# Altium project Quadcopter.prjpcb
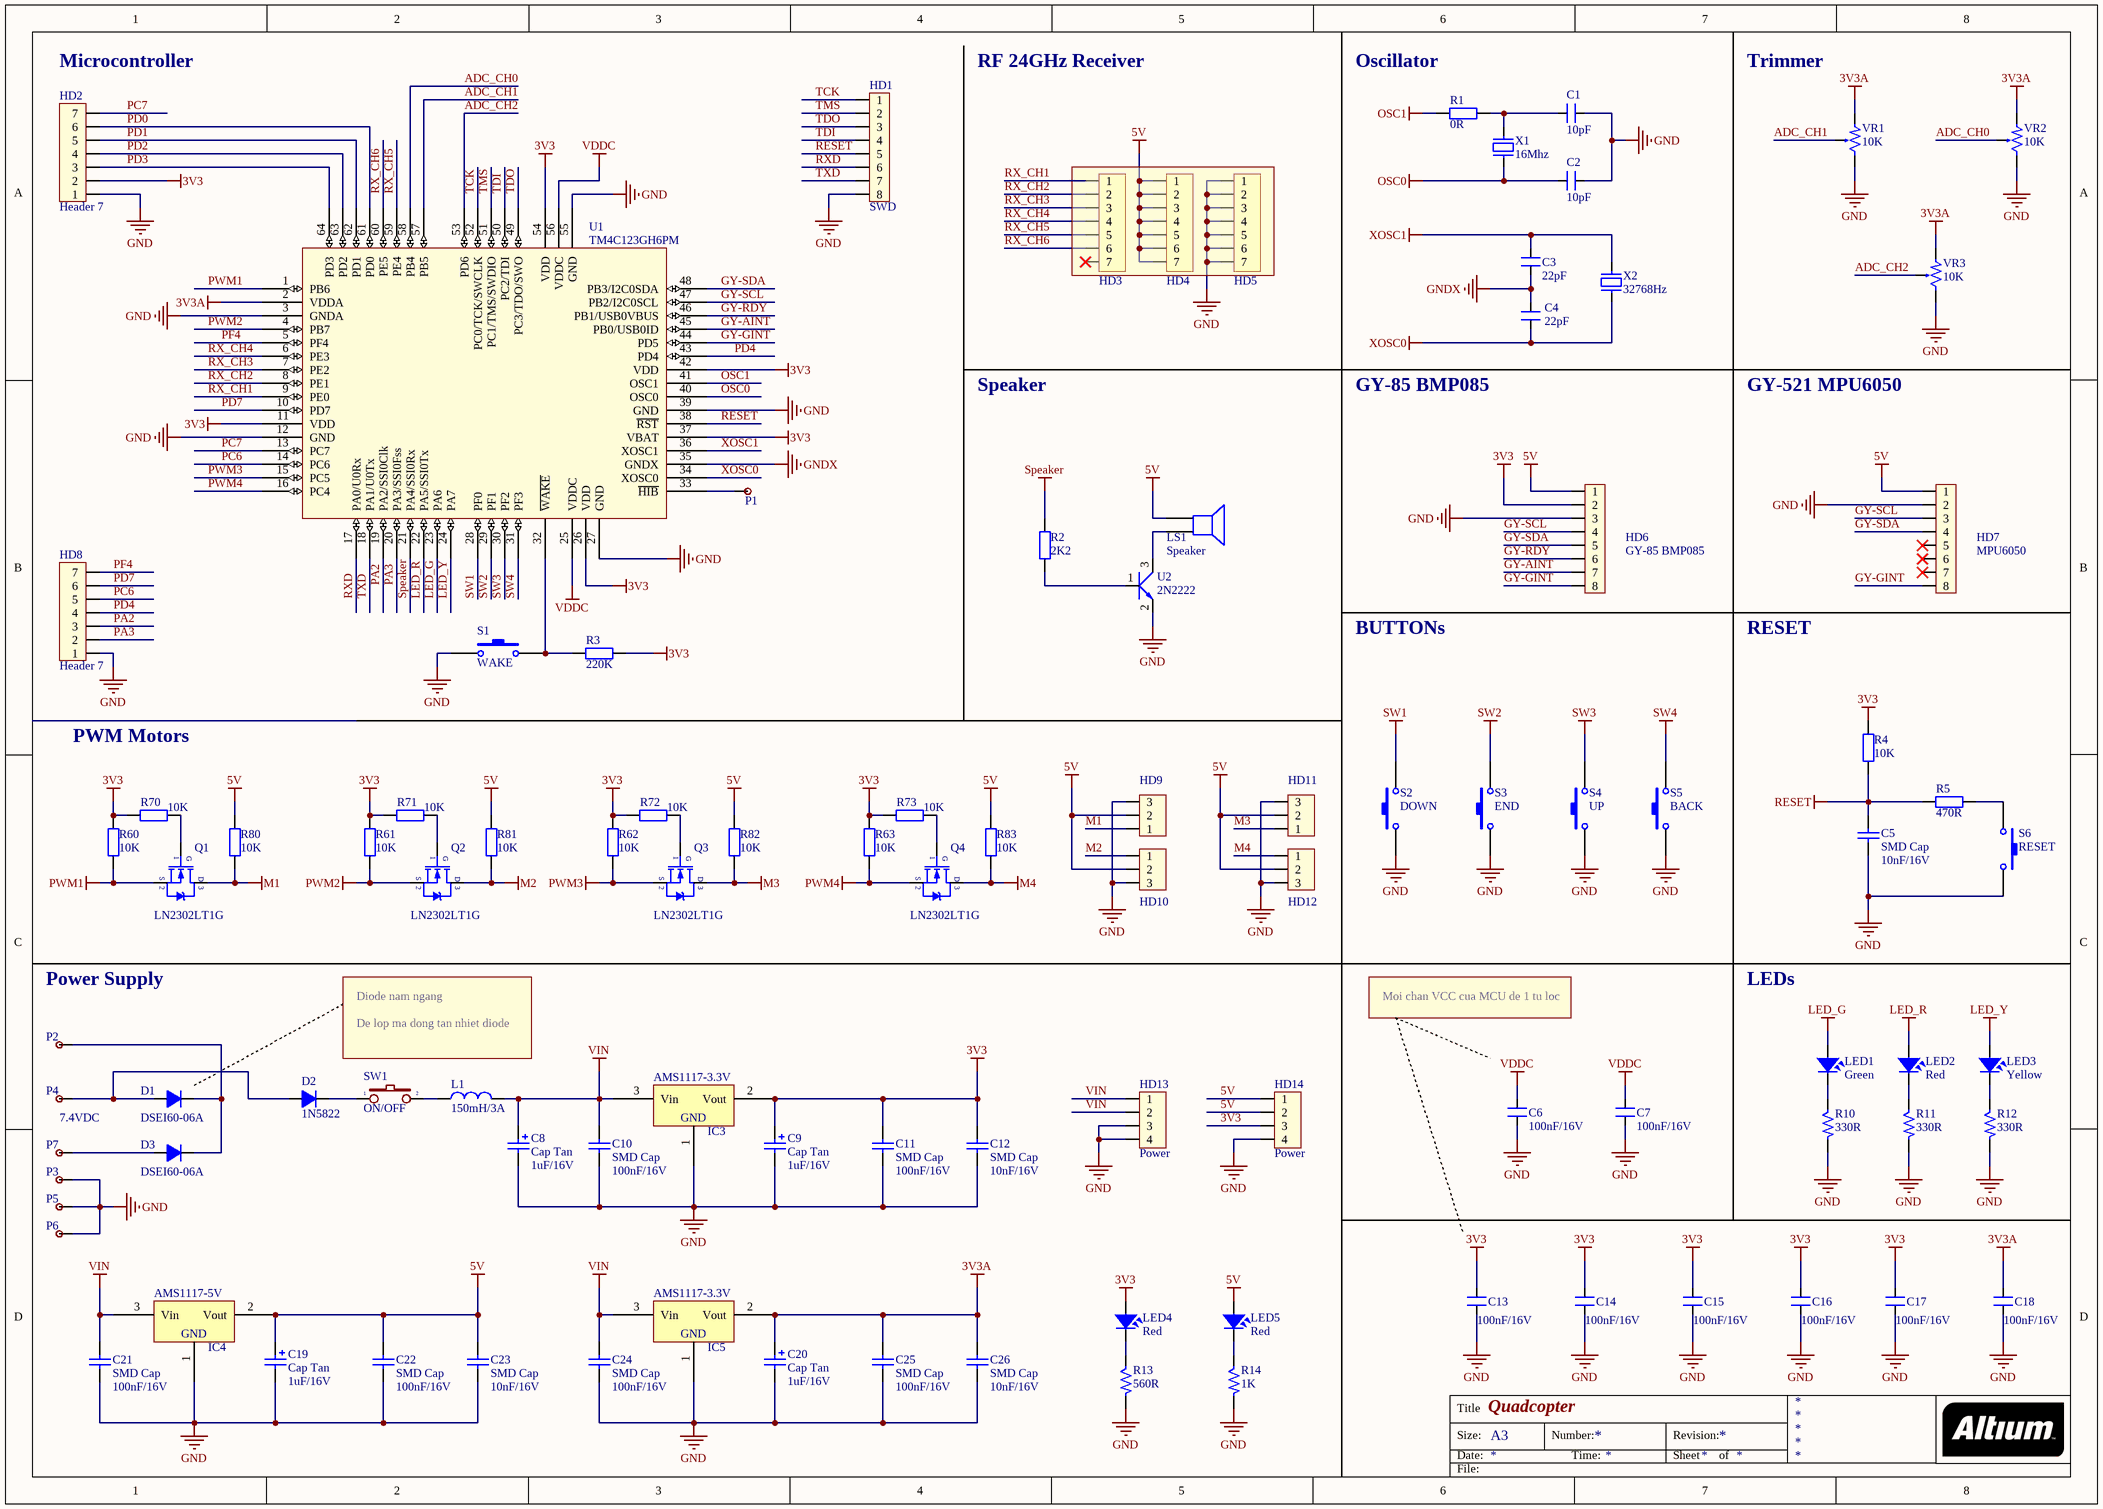
[diagram p0: Quadcopter.schdoc]
1 sheet, 100 parts. Net scope: global (net labels, ports and power ports of the same name join across sheets).
Board file: Quadcopter_final.PcbDoc

## Sheet Quadcopter.schdoc: Quadcopter
size A3

### Parts
C1  10pF  [C0603]
C2  10pF  [C0603]
C3  22pF  [C0603]
C4  22pF  [C0603]
C5  SMD Cap  value 10nF/16V  [C0603]
C6  value 100nF/16V  [C0603]  (hidden comment: SMD Cap)
C7  value 100nF/16V  [C0603]  (hidden comment: SMD Cap)
C8  Cap Tan  value 1uF/16V  [CAP_TANTA_1uF_16V]
C9  Cap Tan  value 1uF/16V  [CAP_TANTA_1uF_16V]
C10  SMD Cap  value 100nF/16V  [C0603]
C11  SMD Cap  value 100nF/16V  [C0603]
C12  SMD Cap  value 10nF/16V  [C0603]
C13  value 100nF/16V  [C0603]  (hidden comment: SMD Cap)
C14  value 100nF/16V  [C0603]  (hidden comment: SMD Cap)
C15  value 100nF/16V  [C0603]  (hidden comment: SMD Cap)
C16  value 100nF/16V  [C0603]  (hidden comment: SMD Cap)
C17  value 100nF/16V  [C0603]  (hidden comment: SMD Cap)
C18  value 100nF/16V  [C0603]  (hidden comment: SMD Cap)
C19  Cap Tan  value 1uF/16V  [CAP_TANTA_1uF_16V]
C20  Cap Tan  value 1uF/16V  [CAP_TANTA_1uF_16V]
C21  SMD Cap  value 100nF/16V  [C0603]
C22  SMD Cap  value 100nF/16V  [C0603]
C23  SMD Cap  value 10nF/16V  [C0603]
C24  SMD Cap  value 100nF/16V  [C0603]
C25  SMD Cap  value 100nF/16V  [C0603]
C26  SMD Cap  value 10nF/16V  [C0603]
D1  DSEI60-06A  [DSEI60-06A_STAND]
D2  1N5822  [1N5822]
D3  DSEI60-06A  [DSEI60-06A_STAND]
HD1  SWD  [Header_8]
HD2  Header 7  [Header_7]
HD3  Header 7  [Header_7]  (value not drawn)
HD4  Header 7  [Header_7]  (value not drawn)
HD5  Header 7  [Header_7]  (value not drawn)
HD6  GY-85 BMP085  [Header_8]
HD7  MPU6050  [Header_8]
HD8  Header 7  [Header_7]
HD9  Header 3  [JP3H_NAM]  (value not drawn)
HD10  Header 3  [JP3H_NAM]  (value not drawn)
HD11  Header 3  [JP3H_NAM]  (value not drawn)
HD12  Header 3  [JP3H_NAM]  (value not drawn)
HD13  Power  [Header_4]
HD14  Power  [Header_4]
IC3  AMS1117-3.3V  [AMS1117-5.0V]
IC4  AMS1117-5V  [AMS1117-5.0V]
IC5  AMS1117-3.3V  [AMS1117-5.0V]
L1  150mH/3A  [Inductor 150mH,3A]
LED1  Green  [Led 0805G]
LED2  Red  [Led 0805R]
LED3  Yellow  [Led 0805Y]
LED4  Red  [Led 0805R]
LED5  Red  [Led 0805R]
LS1  Speaker  [SPEAKER]
P1  Pad  [TP1]  (value not drawn)
P2  Pad  [TP1]  (value not drawn)
P3  Pad  [TP1]  (value not drawn)
P4  Pad  [TP1]  (value not drawn)
P5  Pad  [TP1]  (value not drawn)
P6  Pad  [TP1]  (value not drawn)
P7  Pad  [TP1]  (value not drawn)
Q1  LN2302LT1G  [LN2302LT1G]
Q2  LN2302LT1G  [LN2302LT1G]
Q3  LN2302LT1G  [LN2302LT1G]
Q4  LN2302LT1G  [LN2302LT1G]
R1  value 0R  [RESC2012L]  (hidden comment: Res2)
R2  value 2K2  [RESC2012L]  (hidden comment: Res2)
R3  value 220K  [RESC2012L]  (hidden comment: Res2)
R4  value 10K  [RESC2012L]  (hidden comment: Res2)
R5  value 470R  [RESC2012L]  (hidden comment: Res2)
R10  330R  [RESC2012L]
R11  330R  [RESC2012L]
R12  330R  [RESC2012L]
R13  560R  [RESC2012L]
R14  1K  [RESC2012L]
R60  value 10K  [RESC2012L]  (hidden comment: Res2)
R61  value 10K  [RESC2012L]  (hidden comment: Res2)
R62  value 10K  [RESC2012L]  (hidden comment: Res2)
R63  value 10K  [RESC2012L]  (hidden comment: Res2)
R70  value 10K  [RESC2012L]  (hidden comment: Res2)
R71  value 10K  [RESC2012L]  (hidden comment: Res2)
R72  value 10K  [RESC2012L]  (hidden comment: Res2)
R73  value 10K  [RESC2012L]  (hidden comment: Res2)
R80  value 10K  [RESC2012L]  (hidden comment: Res2)
R81  value 10K  [RESC2012L]  (hidden comment: Res2)
R82  value 10K  [RESC2012L]  (hidden comment: Res2)
R83  value 10K  [RESC2012L]  (hidden comment: Res2)
S1  WAKE  [BUTTON 2PIN TRON]
S2  DOWN  [BUTTON 2PIN TRON]
S3  END  [BUTTON 2PIN TRON]
S4  UP  [BUTTON 2PIN TRON]
S5  BACK  [BUTTON 2PIN TRON]
S6  RESET  [BUTTON 2PIN TRON]
SW1  ON/OFF  [CKCD11-101]
U1  TM4C123GH6PM  [TM4C123GH6PM]
U2  2N2222  [MMBT2222A]
VR1  10K  [VR]
VR2  10K  [VR]
VR3  10K  [VR]
X1  16Mhz  [CSTCE16M0V53-R0]
X2  32768Hz  [32.678 Khz]

### Nets
3V3: C9.1(+) C11.2 C12.2 C13.1 C14.1 C15.1 C16.1 C17.1 HD2.2 HD6.2 HD14.3 IC3.2(Vout) LED4.1 R3.1 R4.2 R60.2 R61.2 R62.2 R63.2 R70.2 R71.2 R72.2 R73.2 U1.11(VDD) U1.26(VDD) U1.37(VBAT) U1.42(VDD) U1.54(VDD)
3V3A: C18.1 C20.1(+) C25.2 C26.2 IC5.2(Vout) U1.2(VDDA) VR1.1 VR2.1 VR3.1
5V: C19.1(+) C22.2 C23.2 HD4.1 HD4.2 HD4.3 HD4.4 HD4.5 HD4.6 HD4.7 HD6.1 HD7.1 HD9.2 HD10.2 HD11.2 HD12.2 HD14.1 HD14.2 IC4.2(Vout) LED5.1 LS1.2 R80.2 R81.2 R82.2 R83.2
GND: C1.1 C2.1 C5.2 C6.2 C7.2 C8.2(-) C9.2(-) C10.1 C11.1 C12.1 C13.2 C14.2 C15.2 C16.2 C17.2 C18.2 C19.2(-) C20.2(-) C21.1 C22.1 C23.1 C24.1 C25.1 C26.1 HD1.8 HD2.1 HD5.1 HD5.2 HD5.3 HD5.4 HD5.5 HD5.6 HD5.7 HD6.3 HD7.2 HD8.1 HD9.3 HD10.3 HD11.3 HD12.3 HD13.3 HD13.4 HD14.4 IC3.1(GND) IC4.1(GND) IC5.1(GND) P3.1 P5.1 P6.1 R10.2 R11.2 R12.2 R13.2 R14.2 S1.1 S2.1 S3.1 S4.1 S5.1 S6.2 U1.3(GNDA) U1.12(GND) U1.27(GND) U1.39(GND) U1.55(GND) U2.2(E) VR1.3 VR2.3 VR3.3
GNDX: C3.2 C4.1 U1.35(GNDX)
LED_G: LED1.1 U1.23(PA6)
LED_R: LED2.1 U1.22(PA5/SSI0Tx)
LED_Y: LED3.1 U1.24(PA7)
M1: HD9.1 Q1.3(D) R80.1
M2: HD10.1 Q2.3(D) R81.1
M3: HD11.1 Q3.3(D) R82.1
M4: HD12.1 Q4.3(D) R83.1
OSC0: C2.2 U1.40(OSC0) X1.2
OSC1: R1.1 U1.41(OSC1)
PWM1: Q1.2(S) R60.1 U1.1(PB6)
PWM2: Q2.2(S) R61.1 U1.4(PB7)
PWM3: Q3.2(S) R62.1 U1.15(PC5)
PWM4: Q4.2(S) R63.1 U1.16(PC4)
RESET: C5.1 HD1.5 R4.1 R5.2 U1.38(~{RST})
Speaker: R2.1 U1.21(PA4/SSI0Rx)
SW1: S2.2 U1.28(PF0)
SW2: S3.2 U1.29(PF1)
SW3: S4.2 U1.30(PF2)
SW4: S5.2 U1.31(PF3)
VDDC: C6.1 C7.1 U1.25(VDDC) U1.56(VDDC)
VIN: C8.1(+) C10.2 C21.2 C24.2 HD13.1 HD13.2 IC3.3(Vin) IC4.3(Vin) IC5.3(Vin) L1.2
XOSC0: C4.2 U1.34(XOSC0) X2.2
XOSC1: C3.1 U1.36(XOSC1) X2.1
ADC_CH0: U1.58(PB4) VR2.2
ADC_CH1: U1.57(PB5) VR1.2
ADC_CH2: U1.53(PD6) VR3.2
GY-AINT: HD6.7 U1.45(PB0/USB0ID)
GY-GINT: HD6.8 HD7.8 U1.44(PD5)
GY-RDY: HD6.6 U1.46(PB1/USB0VBUS)
GY-SCL: HD6.4 HD7.3 U1.47(PB2/I2C0SCL)
GY-SDA: HD6.5 HD7.4 U1.48(PB3/I2C0SDA)
PA2: HD8.3 U1.19(PA2/SSI0Clk)
PA3: HD8.2 U1.20(PA3/SSI0Fss)
PC6: HD8.5 U1.14(PC6)
PC7: HD2.7 U1.13(PC7)
PD0: HD2.6 U1.61(PD0)
PD1: HD2.5 U1.62(PD1)
PD2: HD2.4 U1.63(PD2)
PD3: HD2.3 U1.64(PD3)
PD4: HD8.4 U1.43(PD4)
PD7: HD8.6 U1.10(PD7)
PF4: HD8.7 U1.5(PF4)
RX_CH1: HD3.1 U1.9(PE0)
RX_CH2: HD3.2 U1.8(PE1)
RX_CH3: HD3.3 U1.7(PE2)
RX_CH4: HD3.4 U1.6(PE3)
RX_CH5: HD3.5 U1.59(PE4)
RX_CH6: HD3.6 U1.60(PE5)
RXD: HD1.6 U1.17(PA0/U0Rx)
TCK: HD1.1 U1.52(PC0/TCK/SWCLK)
TDI: HD1.4 U1.50(PC2/TDI)
TDO: HD1.3 U1.49(PC3/TDO/SWO)
TMS: HD1.2 U1.51(PC1/TMS/SWDIO)
TXD: HD1.7 U1.18(PA1/U0Tx)
NetC1_2: C1.2 R1.2 X1.1
NetD1_1: D1.1(K) D2.1(K) P4.1
NetD1_2: D1.2(A) D3.2(A) P2.1
NetD2_2: D2.2(A) SW1.1
NetD3_1: D3.1(K) P7.1
NetL1_1: L1.1 SW1.2
NetLED1_2: LED1.2 R10.1
NetLED2_2: LED2.2 R11.1
NetLED3_2: LED3.2 R12.1
NetLED4_2: LED4.2 R13.1
NetLED5_2: LED5.2 R14.1
NetLS1_1: LS1.1 U2.3(C)
NetP1_1: P1.1 U1.33(~{HIB})
NetQ1_1: Q1.1(G) R70.1
NetQ2_1: Q2.1(G) R71.1
NetQ3_1: Q3.1(G) R72.1
NetQ4_1: Q4.1(G) R73.1
NetR2_2: R2.2 U2.1(B)
NetR3_2: R3.2 S1.2 U1.32(~{WAKE})
NetR5_1: R5.1 S6.1

Not connected (* = marked no-connect by the designer): HD3 7*; HD7 5* 6* 7*

### Notes on the sheet
- (near HD2) Microcontroller
- RF 24GHz Receiver
- (near R1) Oscillator
- Trimmer
- Speaker
- GY-85 BMP085
- GY-521 MPU6050
- BUTTONs
- RESET
- PWM Motors
- Power Supply
- LEDs
- Diode nam ngang
- De lop ma dong tan nhiet diode
- Moi chan VCC cua MCU de 1 tu loc
- (near P4) 7.4VDC
- Title
- Size:
- Date:
- A3
- Number:
- Time:
- Revision:
- Sheet
- of
- File:

### Library data of the parts
C1 C2 = CN1: 0805-SMD Capacitor; Value: 22pF
C3 C4 C6 C7 C13-C18 = CN1: 0805-SMD Capacitor
  C3 C4: Value: 22pF
C5 = Cap: 0805-10nF-50V Cap; Supplier: http://thegioiic.com/products/0805-10nf-50v-cap
C8 C9 C19 C20 = Cap Pol2: Cap Tantalum; Supplier: http://thegioiic.com/products/taja105k016rnj
C10-C12 C21-C26 = Cap Cera: SMD Capacitor
D1 D3 = D1A: Diode 60A; Supplier: http://thegioiic.com/products/dsei60-06a--2
D2 = D1A: Diode  3A
HD1 HD6 HD7 = Hed8: Hedear 8; Creat by: VanDungEvn@Gmail.com
HD2-HD5 HD8 = Hed7: Value: Header 5
HD9-HD12 = Hed3: Header 3 (Green); Value: Header 3
HD13 HD14 = Hed4: Header 4 (Green); Value: Header 4
IC3-IC5 = AMS1117
L1 = L1: Inductor; Value: 150 mH
LED1-LED5 = LED: LED Single colour Green and Red; Value: LED 3 ly Single Colour
LS1 = Speaker: Loudspeaker; Published: 24-Mar-1999; LatestRevisionDate: 17-Jul-2002; LatestRevisionNote: Re-released for DXP Platform.; PackageReference: PIN2; Publisher: Altium Limited
Q1-Q4 = LN2302LT1G: 20V N-Channel Enhancement-Mode MOSFET; Supplier: http://thegioiic.com/products/ln2302lt1g; Price: 2,000VND; Datasheet: http://www.lrc.cn/data/pdf/ln2302lt1g.pdf
R1-R5 R60-R63 R70-R73 R80-R83 = Res2: Resistor; Published: 8-Jun-2000; LatestRevisionDate: 17-Jul-2002; LatestRevisionNote: Re-released for DXP Platform.; PackageReference: AXIAL-0.4; Publisher: Altium Limited; PackageDescription: Axial Device, Thru-Hole; 2 Leads; 0.4 in Pin Spacing
R10-R14 = R: Resistor 1/4W; Value: R1/4W - 1K
S1-S6 = SW-PB: Switch; Published: 24-Mar-1999; LatestRevisionDate: 17-Jul-2002; LatestRevisionNote: Re-released for DXP Platform.; PackageReference: SPST-2; Publisher: Altium Limited; PackageDescription: Switch; 2 Leads
SW1 = SW2: Switch button 2 pin; Value: SW chip 2 pin
U1 = TM4C123GH6PM: Tiva C Series Microcontroller
U2 = 2N2222: NPN switching transistors
VR1-VR3 = VR1: Var Resistor; Value: VR 10K; Supplier: http://thegioiic.com/products/trim10k
X1 X2 = XT2: Crystal For all Crystal 2pin.; Value: 4Mhz